# EAGLE design screen (EAGLE 9.6.1)

## Sheet 1 of 2
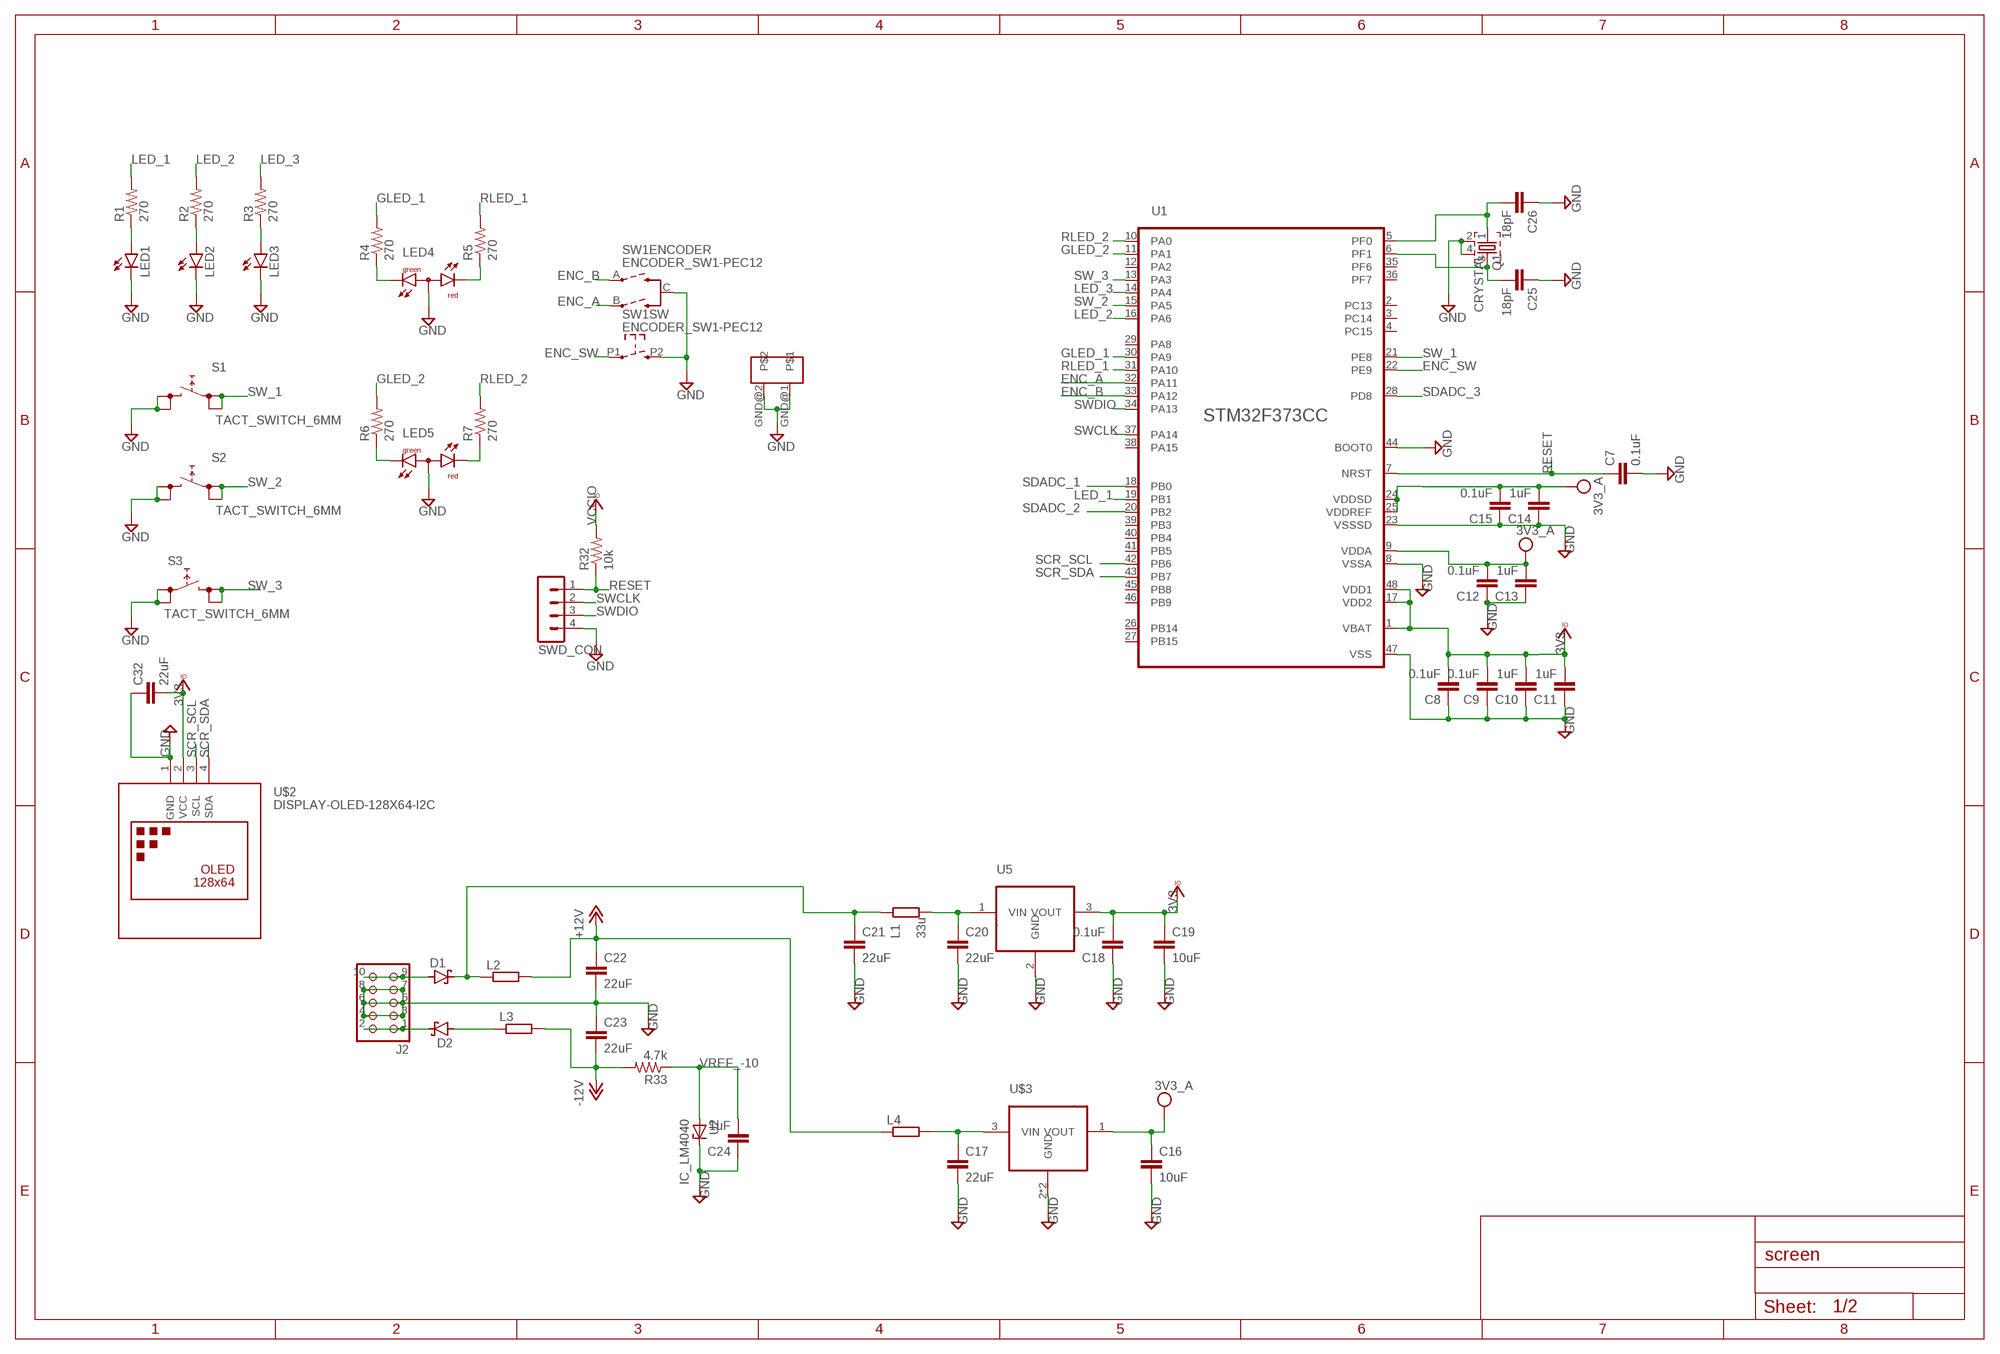
[diagram p0: schematic, sheet 1]

### Parts
C7  0.1uF  C-EUC0603  [C0603]
C8  0.1uF  C-EUC0603  [C0603]
C9  0.1uF  C-EUC0603  [C0603]
C10  1uF  C-EUC0603  [C0603]
C11  1uF  C-EUC0603  [C0603]
C12  0.1uF  C-EUC0603  [C0603]
C13  1uF  C-EUC0603  [C0603]
C14  1uF  C-EUC0603  [C0603]
C15  0.1uF  C-EUC0603  [C0603]
C16  10uF  C-EUC1206  [C1206]
C17  22uF  C-EUC1206  [C1206]
C18  0.1uF  C-EUC0603  [C0603]
C19  10uF  C-EUC1206  [C1206]
C20  22uF  C-EUC1206  [C1206]
C21  22uF  C-EUC1206  [C1206]
C22  22uF  C-EUC1206  [C1206]
C23  22uF  C-EUC1206  [C1206]
C24  1uF  C-EUC0603  [C0603]
C25  18pF  C-EUC0603  [C0603]
C26  18pF  C-EUC0603  [C0603]
C32  22uF  C-EUC1206  [C1206]
D1  SMF5.0AT1  [SOD123FL]
D2  SMF5.0AT1  [SOD123FL]
J2  CON_HEADER_2X05-PTH+SHROUDED_A  [PINSHRD_PTH_2X05]
L1  33u  R-EU_R0805  [R0805]
L2  R-EU_R0603  [R0603]
L3  R-EU_R0603  [R0603]
L4  R-EU_R0603  [R0603]
LED1  LED3MM  [LED3MM]
LED2  LED3MM  [LED3MM]
LED3  LED3MM  [LED3MM]
LED4  L-115WEGW-CA  [DUOLED-A-3MM]
LED5  L-115WEGW-CA  [DUOLED-A-3MM]
Q1  CRYSTAL  [CTS406]
R1  270  R-US_R0603  [R0603]
R2  270  R-US_R0603  [R0603]
R3  270  R-US_R0603  [R0603]
R4  270  R-US_R0603  [R0603]
R5  270  R-US_R0603  [R0603]
R6  270  R-US_R0603  [R0603]
R7  270  R-US_R0603  [R0603]
R32  10k  R-US_R0603  [R0603]
R33  4.7k  R-US_R0603  [R0603]
S1  TACT_SWITCH_6MM  [TACT_SWITCH_6MM]
S2  TACT_SWITCH_6MM  [TACT_SWITCH_6MM]
S3  TACT_SWITCH_6MM  [TACT_SWITCH_6MM]
SW1  ENCODER_SW1-PEC12  [PEC12_INCREMENTAL_ENCODER]
SWD_CON  MA04-1  [MA04-1]
U1  STM32F373LQFP48  [LQFP48]
U2  IC_LM4040  [SOT-23]
U5  R-78E-0.5  [TO-220_RECOM]
U$2  DISPLAY-OLED-128X64-I2C  [DISPLAY-OLED-128X64-I2C]
U$3  LD2981ABUSOT89  [SOT89]

### Nets
+12V: C22.1 L2.2 L4.1 ; also sheet 2
-12V: C23.2 L3.2 R33.2 ; also sheet 2
ENC_A: SW1.B(ENCODER:B) U1.32(PA11)
ENC_B: SW1.A(ENCODER:A) U1.33(PA12)
ENC_SW: SW1.P1 U1.22(PE9)
GLED_1: R4.2 U1.30(PA9)
GLED_2: R6.2 U1.11(PA1)
GND: C7.2 C8.1 C9.1 C10.1 C11.1 C12.1 C13.1 C14.1 C15.1 C16.2 C17.2 C18.1 C19.2 C20.2 C21.2 C22.2 C23.1 C24.1 C25.1 C26.1 C32.1 J2.3 J2.4 J2.5 J2.6 J2.7 J2.8 LED1.K(C) LED2.K(C) LED3.K(C) LED4.2(A) LED5.2(A) Q1.2 Q1.4 S1.P$3 S1.P$4 S2.P$3 S2.P$4 S3.P$1 S3.P$2 SW1.C(ENCODER:C) SW1.GND@1 SW1.GND@2 SW1.P2 SWD_CON.4 U1.8(VSSA) U1.23(VSSSD) U1.44(BOOT0) U1.47(VSS) U2.1(C) U5.2(GND) U$2.1(GND) U$3.2(GND) U$3.2@1(GND) ; also sheet 2
LED_1: R1.2 U1.19(PB1)
LED_2: R2.2 U1.16(PA6)
LED_3: R3.2 U1.14(PA4)
N$3: LED1.A R1.1
N$4: LED2.A R2.1
N$5: LED3.A R3.1
N$6: LED4.1(CG) R4.1
N$7: LED4.3(CR) R5.1
N$8: C25.2 Q1.3 U1.6(PF1)
N$11: D2.C J2.1 J2.2
N$12: LED5.1(CG) R6.1
N$13: LED5.3(CR) R7.1
N$26: D1.A J2.9 J2.10
N$31: C21.1 D1.C L1.1 L2.1
N$32: C26.2 Q1.1 U1.5(PF0)
N$33: C20.1 L1.2 U5.1(VIN)
N$43: C17.1 L4.2 U$3.3(VIN)
N$44: D2.A L3.1
RESET: C7.1 R32.1 SWD_CON.1 U1.7(NRST)
RLED_1: R5.2 U1.31(PA10)
RLED_2: R7.2 U1.10(PA0)
SCR_SCL: U1.42(PB6) U$2.3(SCL)
SCR_SDA: U1.43(PB7) U$2.4(SDA)
SDADC_1: U1.18(PB0) ; also sheet 2
SDADC_2: U1.20(PB2) ; also sheet 2
SDADC_3: U1.28(PD8) ; also sheet 2
SW_1: S1.P$1 S1.P$2 U1.21(PE8)
SW_2: S2.P$1 S2.P$2 U1.15(PA5)
SW_3: S3.P$3 S3.P$4 U1.13(PA3)
SWCLK: SWD_CON.2 U1.37(PA14)
SWDIO: SWD_CON.3 U1.34(PA13)
VCC: C12.2 C13.2 C14.2 C15.2 C16.1 U1.9(VDDA) U1.24(VDDSD) U1.25(VDDREF) U$3.1(VOUT) ; supply symbol labelled 3V3_A ; also sheet 2
VCCIO: C8.2 C9.2 C10.2 C11.2 C18.2 C19.1 C32.2 R32.2 U1.1(VBAT) U1.17(VDD2) U1.48(VDD1) U5.3(VOUT) U$2.2(VCC) ; supply symbol labelled 3V3
VREF_-10: C24.2 R33.1 U2.2(A) U2.3(A) ; also sheet 2
Unconnected: U1.2(PC13) U1.3(PC14) U1.4(PC15) U1.12(PA2) U1.26(PB14) U1.27(PB15) U1.29(PA8) U1.35(PF6) U1.36(PF7) U1.38(PA15) U1.39(PB3) U1.40(PB4) U1.41(PB5) U1.45(PB8) U1.46(PB9)

## Sheet 2 of 2
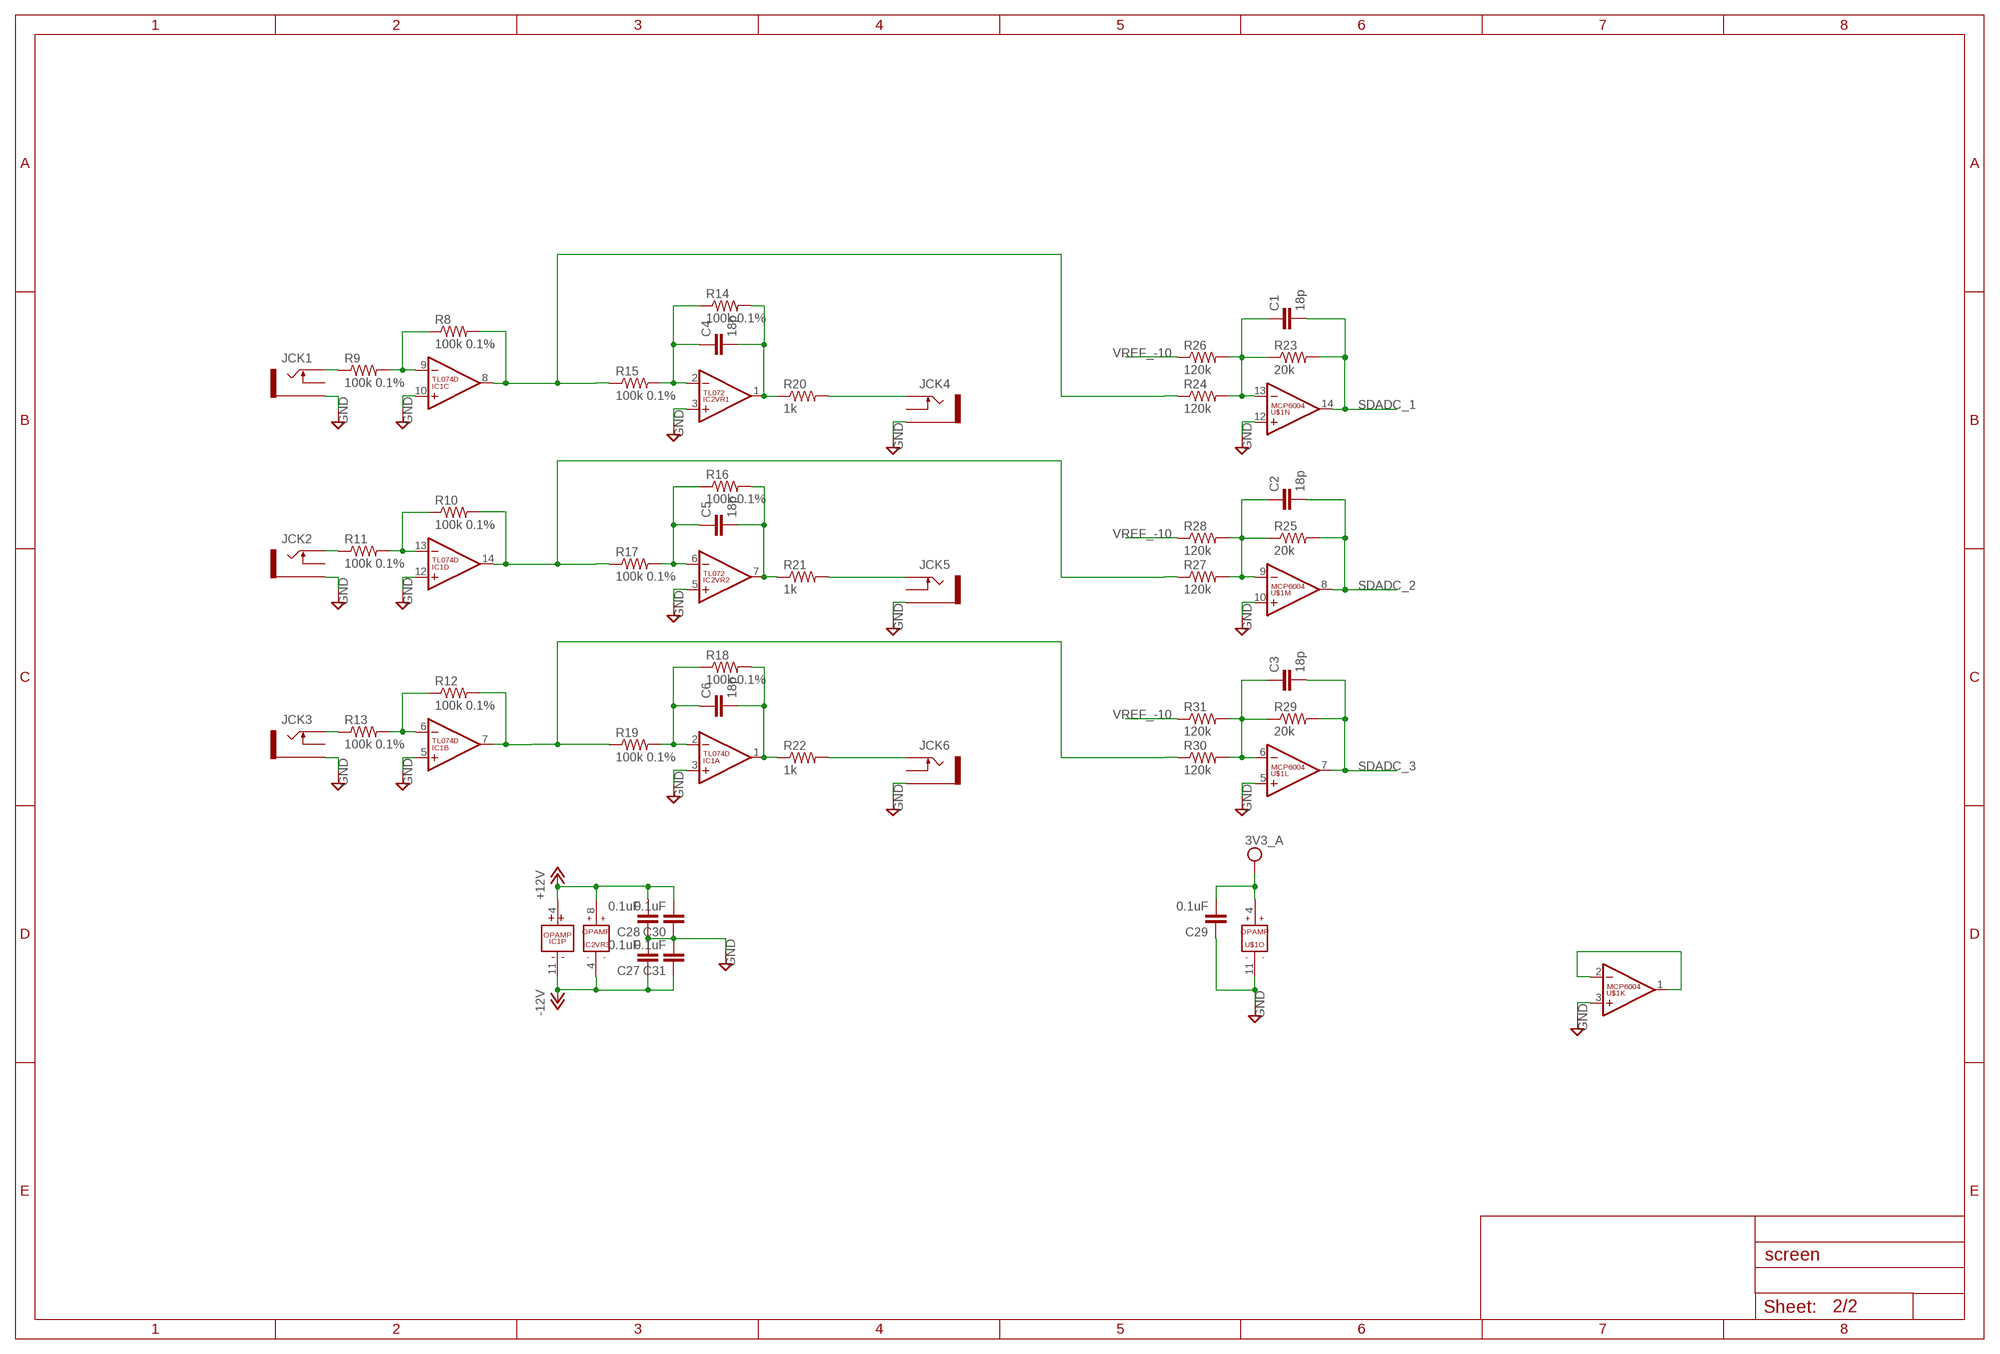
[diagram p1: schematic, sheet 2]

### Parts
C1  18p  C-EUC0603  [C0603]
C2  18p  C-EUC0603  [C0603]
C3  18p  C-EUC0603  [C0603]
C4  18p  C-EUC0603  [C0603]
C5  18p  C-EUC0603  [C0603]
C6  18p  C-EUC0603  [C0603]
C27  0.1uF  C-EUC0603  [C0603]
C28  0.1uF  C-EUC0603  [C0603]
C29  0.1uF  C-EUC0603  [C0603]
C30  0.1uF  C-EUC0603  [C0603]
C31  0.1uF  C-EUC0603  [C0603]
IC1  TL074D  [SO14]
IC2  TL072  [SO08]
JCK1  THONKICONNNEW  [WQP-PJ301M-12_JACK]
JCK2  THONKICONNNEW  [WQP-PJ301M-12_JACK]
JCK3  THONKICONNNEW  [WQP-PJ301M-12_JACK]
JCK4  THONKICONNNEW  [WQP-PJ301M-12_JACK]
JCK5  THONKICONNNEW  [WQP-PJ301M-12_JACK]
JCK6  THONKICONNNEW  [WQP-PJ301M-12_JACK]
R8  100k 0.1%  R-US_R0603  [R0603]
R9  100k 0.1%  R-US_R0603  [R0603]
R10  100k 0.1%  R-US_R0603  [R0603]
R11  100k 0.1%  R-US_R0603  [R0603]
R12  100k 0.1%  R-US_R0603  [R0603]
R13  100k 0.1%  R-US_R0603  [R0603]
R14  100k 0.1%  R-US_R0603  [R0603]
R15  100k 0.1%  R-US_R0603  [R0603]
R16  100k 0.1%  R-US_R0603  [R0603]
R17  100k 0.1%  R-US_R0603  [R0603]
R18  100k 0.1%  R-US_R0603  [R0603]
R19  100k 0.1%  R-US_R0603  [R0603]
R20  1k  R-US_R0603  [R0603]
R21  1k  R-US_R0603  [R0603]
R22  1k  R-US_R0603  [R0603]
R23  20k  R-US_R0603  [R0603]
R24  120k  R-US_R0603  [R0603]
R25  20k  R-US_R0603  [R0603]
R26  120k  R-US_R0603  [R0603]
R27  120k  R-US_R0603  [R0603]
R28  120k  R-US_R0603  [R0603]
R29  20k  R-US_R0603  [R0603]
R30  120k  R-US_R0603  [R0603]
R31  120k  R-US_R0603  [R0603]
U$1  MCP6004  [SO14]

### Nets
+12V: C28.2 C30.2 IC1.4(P:V+) IC2.8(VR3:V+) ; also sheet 1
-12V: C27.1 C31.1 IC1.11(P:V-) IC2.4(VR3:V-) ; also sheet 1
GND: C27.2 C28.1 C29.1 C30.1 C31.2 IC1.3(A:+IN) IC1.5(B:+IN) IC1.10(C:+IN) IC1.12(D:+IN) IC2.3(VR1:+IN) IC2.5(VR2:+IN) JCK1.P$3_SLEEVE(SLEEVE) JCK2.P$3_SLEEVE(SLEEVE) JCK3.P$3_SLEEVE(SLEEVE) JCK4.P$3_SLEEVE(SLEEVE) JCK5.P$3_SLEEVE(SLEEVE) JCK6.P$3_SLEEVE(SLEEVE) U$1.3(K:+IN) U$1.5(L:+IN) U$1.10(M:+IN) U$1.11(O:V-) U$1.12(N:+IN) ; also sheet 1
N$1: IC1.9(C:-IN) R8.1 R9.2
N$2: IC1.13(D:-IN) R10.1 R11.2
N$9: C6.2 IC1.1(A:OUT) R18.2 R22.1
N$10: C1.1 R23.1 R24.2 R26.2 U$1.13(N:-IN)
N$14: JCK1.P$1_TIP(TIP) R9.1
N$15: JCK2.P$1_TIP(TIP) R11.1
N$16: IC1.6(B:-IN) R12.1 R13.2
N$17: C4.2 IC2.1(VR1:OUT) R14.2 R20.1
N$18: JCK3.P$1_TIP(TIP) R13.1
N$19: C4.1 IC2.2(VR1:-IN) R14.1 R15.2
N$20: U$1.1(K:OUT) U$1.2(K:-IN)
N$21: C5.2 IC2.7(VR2:OUT) R16.2 R21.1
N$22: C5.1 IC2.6(VR2:-IN) R16.1 R17.2
N$23: C2.1 R25.1 R27.2 R28.2 U$1.9(M:-IN)
N$25: C6.1 IC1.2(A:-IN) R18.1 R19.2
N$27: C3.1 R29.1 R30.2 R31.2 U$1.6(L:-IN)
N$28: JCK5.P$1_TIP(TIP) R21.2
N$29: JCK4.P$1_TIP(TIP) R20.2
N$30: JCK6.P$1_TIP(TIP) R22.2
SDADC_1: C1.2 R23.2 U$1.14(N:OUT) ; also sheet 1
SDADC_2: C2.2 R25.2 U$1.8(M:OUT) ; also sheet 1
SDADC_3: C3.2 R29.2 U$1.7(L:OUT) ; also sheet 1
SIGNAL_1: IC1.8(C:OUT) R8.2 R15.1 R24.1
SIGNAL_2: IC1.14(D:OUT) R10.2 R17.1 R27.1
SIGNAL_3: IC1.7(B:OUT) R12.2 R19.1 R30.1
VCC: C29.2 U$1.4(O:V+) ; supply symbol labelled 3V3_A ; also sheet 1
VREF_-10: R26.1 R28.1 R31.1 ; also sheet 1
Unconnected: JCK1.P$2_SWITCH(SWITCH) JCK2.P$2_SWITCH(SWITCH) JCK3.P$2_SWITCH(SWITCH) JCK4.P$2_SWITCH(SWITCH) JCK5.P$2_SWITCH(SWITCH) JCK6.P$2_SWITCH(SWITCH)

## Library data of the parts
C1-C32 = resistor:C-EU: CAPACITOR, European symbol
D1 D2 = diode:SMF5.0AT1: 200 W Transient Voltage Suppressor Source: Data sheet <http://www.onsemi.com/pub_link/Collateral/SMF5.0AT1-D.PDF>
IC1 = EurorackModularParts:TL074: OP AMP
IC2 = EurorackModularParts:TL072
J2 = dp_devices:CON_HEADER_2X05: 2x05 pin header
JCK1-JCK6 = BitFox:THONKICONN: 3.5mm socket for Eurorack modular synths
L1-L4 = resistor:R-EU_: RESISTOR, European symbol
LED1-LED3 = led:LED: LED OSRAM: - CHIPLED LG R971, LG N971, LY N971, LG Q971, LY Q971, LO R971, LY R971 LH N974, LH R974 LS Q976, LO Q976, LY Q976 LO Q996 - Hyper CHIPLED LW Q18S LB Q993, LB Q99A, LB R99A - SideLED LS A670, LO A670, LY A670, LG A670, LP A670 LB A673, LV A673, LT A673, LW A673 LH A674 LY A675 LS A676, LA A676, LO A676, LY A676, LW A676 LS A679, LY A679, LG A679 - Hyper Micro SIDELED® LS Y876, LA Y876, LO Y876, LY Y876 LT Y87S - SmartLED LW L88C, LW L88S LB L89C, LB L89S, LG L890 LS L89K, LO L89K, LY L89K LS L896, LA L896, LO L896, LY L896 - TOPLED LS T670, LO T670, LY T670, LG T670, LP T670 LSG T670, LSP T670, LSY T670, LOP T670, LYG T670 LG T671, LOG T671, LSG T671 LB T673, LV T673, LT T673, LW T673 LH T674 LS T676, LA T676, LO T676, LY T676, LB T676, LH T676, LSB T676, LW T676 LB T67C, LV T67C, LT T67C, LS T67K, LO T67K, LY T67K, LW E67C LS E67B, LA E67B, LO E67B, LY E67B, LB E67C, LV E67C, LT E67C LW T67C LS T679, LY T679, LG T679 LS T770, LO T770, LY T770, LG T770, LP T770 LB T773, LV T773, LT T773, LW T773 LH T774 LS E675, LA E675, LY E675, LS T675 LS T776, LA T776, LO T776, LY T776, LB T776 LHGB T686 LT T68C, LB T68C - Hyper Mini TOPLED® LB M676 - Mini TOPLED Santana® LG M470 LS M47K, LO M47K, LY M47K Source: http://www.osram.convergy.de LUXEON: - LUMILED® LXK2-PW12-R00, LXK2-PW12-S00, LXK2-PW14-U00, LXK2-PW14-V00 LXK2-PM12-R00, LXK2-PM12-S00, LXK2-PM14-U00 LXK2-PE12-Q00, LXK2-PE12-R00, LXK2-PE12-S00, LXK2-PE14-T00, LXK2-PE14-U00 LXK2-PB12-K00, LXK2-PB12-L00, LXK2-PB12-M00, LXK2-PB14-N00, LXK2-PB14-P00, LXK2-PB14-Q00 LXK2-PR12-L00, LXK2-PR12-M00, LXK2-PR14-Q00, LXK2-PR14-R00 LXK2-PD12-Q00, LXK2-PD12-R00, LXK2-PD12-S00 LXK2-PH12-R00, LXK2-PH12-S00 LXK2-PL12-P00, LXK2-PL12-Q00, LXK2-PL12-R00 Source: www.luxeon.com KINGBRIGHT: KA-3528ASYC Source: www.kingbright.com
LED4 LED5 = led:L-115WEGW-CA: T-1(3mm) BI-COLOR INDICATOR LAMP Source: Kingbright .. 2_colour_led_.pdf
Q1 = BitFox:CRYSTAL
R1-R33 = resistor:R-US_: RESISTOR, American symbol
S1-S3 = BitFox:TACT_SWITCH_6MM
SW1 = dp_devices.v6:ENCODER_SW1: Incremental Encoder with push switch
SWD_CON = con-lstb:MA04-1: PIN HEADER; OC_FARNELL: unknown; OC_NEWARK: unknown
U1 = BitFox:STM32F373
U2 = dp_devices.v6:IC_LM4040: LM4040 Precision Micropower Shunt Voltage Reference
U5 = BitFox:R-78E-0.5
U$1 = EurorackModularParts:MCP6004
U$2 = diy-modules:DISPLAY-OLED-128X64-I2C: 128x64 Dot Matrix OLED Module based on SSD1306 chip Variant with I2C interface More details available here: http://www.instructables.com/id/Monochrome-096-i2c-OLED-display-with-arduino-SSD13/ SSD1306 datasheet: https://cdn-shop.adafruit.com/datasheets/SSD1306.pdf Click here to find device on ebay.com <http://www.ebay.com/sch/oled+display+128x64+iic> Note: There are two variants: I2C and SPI. Search for the proper version.
U$3 = BitFox:LD2981ABU

## Board
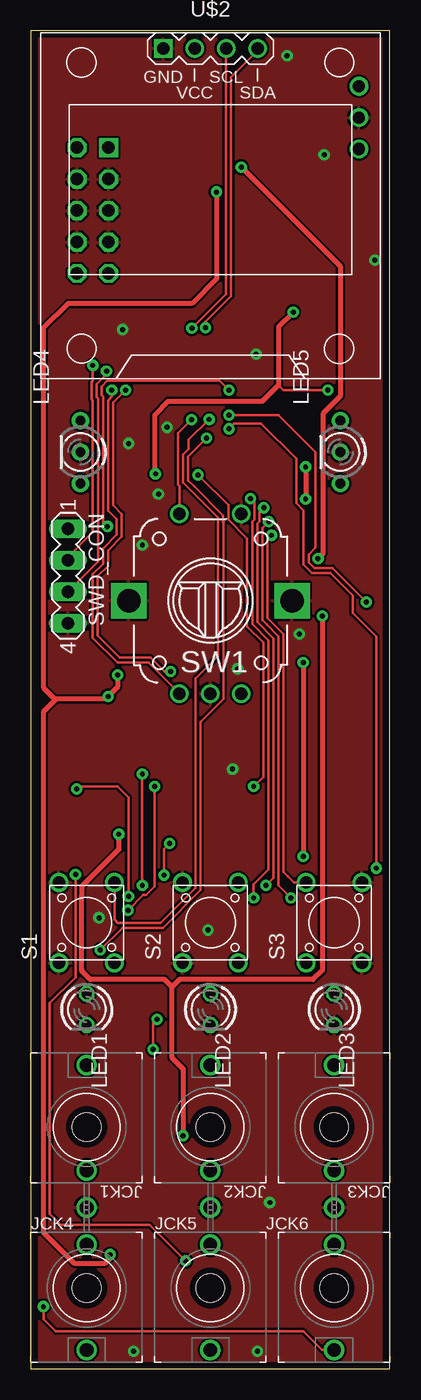
[diagram p2: board, top side]
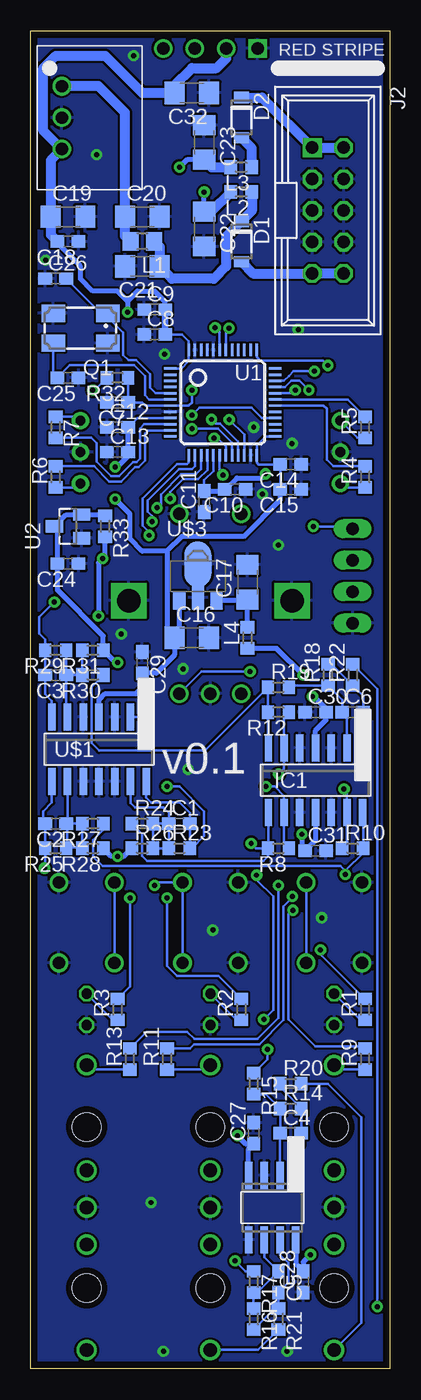
[diagram p3: board, bottom side, seen from below]

Size 29 x 108 mm. Coordinates in mm from the lower left corner, seen from the top.
Outline: 0,0 29,0 29,108 0,108 0,0
Copper layers (1*16): Top 0.035mm / dielectric 1.5mm / Bottom 0.035mm
Design rules "PCBCart-Standard *": minimum track width 8mil, minimum drill 0.4mm, track to track 7mil, track to pad 7mil, pad to pad 7mil, via to via 7mil, smd to smd 7mil, copper to edge 20mil, drill to drill 8mil, minimum pad ring 8mil, minimum via ring 10mil, stop-mask expansion 3mil, vias tented up to drill 25mil, thermal gap 8mil

### Footprints (pad centres in the part's own frame; a part is rotated, then mirrored left to right if it is on the bottom)
C0603 = smd 1.1 x 1: 1 -0.85,0; 2 0.85,0
C1206 = smd 1.6 x 1.8: 1 -1.4,0; 2 1.4,0
SOD123FL = smd 0.91 x 1.22: A 1.625,0; C -1.625,0
SO14 = smd 0.6 x 2.2: 1 -3.81,-2.6; 2 -2.54,-2.6; 3 -1.27,-2.6; 4 0,-2.6; 5 1.27,-2.6; 6 2.54,-2.6; 7 3.81,-2.6; 8 3.81,2.6; 9 2.54,2.6; 10 1.27,2.6; 11 0,2.6; 12 -1.27,2.6; 13 -2.54,2.6; 14 -3.81,2.6
SO08 = smd 0.6 x 2.2: 1 -1.905,-2.6; 2 -0.635,-2.6; 3 0.635,-2.6; 4 1.905,-2.6; 5 1.905,2.6; 6 0.635,2.6; 7 -0.635,2.6; 8 -1.905,2.6
PINSHRD_PTH_2X05 = drill 1.016 square: 1 -5.08,-1.27 | drill 1.016 octagon: 2 -5.08,1.27; 3 -2.54,-1.27; 4 -2.54,1.27; 5 0,-1.27; 6 0,1.27; 7 2.54,-1.27; 8 2.54,1.27; 9 5.08,-1.27; 10 5.08,1.27
WQP-PJ301M-12_JACK = drill 1.1: P$1_TIP 0,5; P$2_SWITCH 0,-3.5; P$3_SLEEVE 0,-6.5 | hole 2.286: 0,0
R0805 = smd 1.3 x 1.5: 1 -0.95,0; 2 0.95,0
R0603 = smd 1 x 1.1: 1 -0.85,0; 2 0.85,0
LED3MM = drill 0.813 octagon: A -1.27,0; K 1.27,0
DUOLED-A-3MM = drill 0.8 pad 1.4: 1 -2.54,0; 2 0,0; 3 2.54,0
CTS406 = smd 1.9 x 1.4: 1 -2.2,-1.2; 2 2.2,-1.2; 3 2.2,1.2; 4 -2.2,1.2
TACT_SWITCH_6MM = drill 1: P$1 -3.25,-2.25; P$2 3.25,-2.25; P$3 -3.25,2.25; P$4 3.25,2.25
PEC12_INCREMENTAL_ENCODER = drill 1: A -2.5,-7.5; B 2.5,-7.5; C 0,-7.5; P1 -2.5,7; P2 2.5,7 | drill 1.9 square: GND@1 -6.6,0; GND@2 6.6,0
MA04-1 = drill 1.016 long: 1 -3.81,0; 2 -1.27,0; 3 1.27,0; 4 3.81,0
LQFP48 = smd 1 x 0.2: 1 -4.25,2.75; 2 -4.25,2.25; 3 -4.25,1.75; 4 -4.25,1.25; 5 -4.25,0.75; 6 -4.25,0.25; 7 -4.25,-0.25; 8 -4.25,-0.75; 9 -4.25,-1.25; 10 -4.25,-1.75; 11 -4.25,-2.25; 12 -4.25,-2.75; 25 4.25,-2.75; 26 4.25,-2.25; 27 4.25,-1.75; 28 4.25,-1.25; 29 4.25,-0.75; 30 4.25,-0.25; 31 4.25,0.25; 32 4.25,0.75; 33 4.25,1.25; 34 4.25,1.75; 35 4.25,2.25; 36 4.25,2.75 | smd 0.2 x 1: 13 -2.75,-4.25; 14 -2.25,-4.25; 15 -1.75,-4.25; 16 -1.25,-4.25; 17 -0.75,-4.25; 18 -0.25,-4.25; 19 0.25,-4.25; 20 0.75,-4.25; 21 1.25,-4.25; 22 1.75,-4.25; 23 2.25,-4.25; 24 2.75,-4.25; 37 2.75,4.25; 38 2.25,4.25; 39 1.75,4.25; 40 1.25,4.25; 41 0.75,4.25; 42 0.25,4.25; 43 -0.25,4.25; 44 -0.75,4.25; 45 -1.25,4.25; 46 -1.75,4.25; 47 -2.25,4.25; 48 -2.75,4.25
SOT-23 = smd 1 x 1.4: 1 -0.95,-1.1; 2 0.95,-1.1; 3 0,1.1
TO-220_RECOM = drill 1: 1 -2.54,0; 2 0,0; 3 2.54,0
DISPLAY-OLED-128X64-I2C = drill 1 square: 1 -3.81,12.7 | drill 1: 2 -1.27,12.7; 3 1.27,12.7; 4 3.81,12.7
SOT89 = smd 1 x 1.5: 1 -1.499,-1.981; 3 1.499,-1.981 | smd 1 x 2: 2 0,-1.727 | smd 2.2 x 3.7: 2@1 0,0.94

### Placement (x,y rotation side)
C1  17,44 0 bottom
C2  27,44 180 bottom
C3  27,56 180 bottom
C4  8,19 0 bottom
C5  9,7 270 bottom
C6  3,53 0 bottom
C7  22,78 180 bottom
C8  19,83.5 0 bottom
C9  19,85.5 0 bottom
C10  12.5,71 180 bottom
C11  15,70 90 bottom
C12  22,76 0 bottom
C13  22,74 0 bottom
C14  8,73 180 bottom
C15  8,71 180 bottom
C16  16,59 0 bottom
C17  11.5,63.5 90 bottom
C18  26,91 180 bottom
C19  26,93 0 bottom
C20  20,93 0 bottom
C21  20,89 180 bottom
C22  15,92 270 bottom
C23  15,99 270 bottom
C24  26,65 180 bottom
C25  26,80 180 bottom
C26  27,88 0 bottom
C27  11,19 90 bottom
C28  7,7 90 bottom
C29  20,57 270 bottom
C30  6,53 0 bottom
C31  6,41.8 0 bottom
C32  16,103 180 bottom
D1  12,91 270 bottom
D2  12,101 270 bottom
IC1  6,47.5 180 bottom
IC2  9.5,13 180 bottom
J2  5,93.5 270 bottom
JCK1  4.5,19.5 0 top
JCK2  14.5,19.5 0 top
JCK3  24.5,19.5 0 top
JCK4  4.5,6.5 180 top
JCK5  14.5,6.5 180 top
JCK6  24.5,6.5 180 top
L1  20,91 180 bottom
L2  12,95 180 bottom
L3  12,97 180 bottom
L4  11.5,59 90 bottom
LED1  4.5,29 270 top
LED2  14.5,29 270 top
LED3  24.5,29 270 top
LED4  4,74 90 top
LED5  25,74 90 top
Q1  25,84 180 bottom
R1  2,29 90 bottom
R2  12,29 90 bottom
R3  22,29 90 bottom
R4  2,72 90 bottom
R5  2,76 90 bottom
R6  27,72 90 bottom
R7  27,76 270 bottom
R8  9,42 180 bottom
R9  2,25 90 bottom
R10  3,42 0 bottom
R11  18,25 90 bottom
R12  9,53 180 bottom
R13  21,25 90 bottom
R14  8,21 0 bottom
R15  11,23 270 bottom
R16  11,4 270 bottom
R17  11,7 270 bottom
R18  5,56 90 bottom
R19  9,55 0 bottom
R20  8,23 0 bottom
R21  9,4 270 bottom
R22  3,56 90 bottom
R23  17,42 0 bottom
R24  20,44 0 bottom
R25  27,42 180 bottom
R26  20,42 0 bottom
R27  24,44 180 bottom
R28  24,42 180 bottom
R29  27,58 180 bottom
R30  24,56 180 bottom
R31  24,58 180 bottom
R32  22,80 180 bottom
R33  23,68 270 bottom
S1  4.5,36 90 top
S2  14.5,36 90 top
S3  24.5,36 90 top
SW1  14.5,62 0 top
SWD_CON  3,64 270 top
U1  13.5,78 0 bottom
U2  26,68 90 bottom
U5  26.5,101 270 bottom
U$1  23.5,50 180 bottom
U$2  14.5,93.9 0 top
U$3  15.5,64 0 bottom

### Tracks (layer width: path | path; a pad name or v marks a point on that pad's centre or on a via)
+12V  (via drill 0.4)
  Top 0.406: v15,95 15,88 13,86 3,86 1,84 1,55 1.94,54.06 | 1.94,54.06 1.94,53.94 1,53 1,11 3.5,8.5 6,8.5 6.4,8.9 v6.4,9.2 | v7,56 7,55.03 v6.24,54.27 6.04,54.06 1.94,54.06
  Bottom 0.406: IC1.4 6,51.5 5.15,52.35 C30.2 5.15,53.28 6.13,54.27 v6.24,54.27 | C22.1 v15,95 | v7,56 9.15,58.15 L4.1 | IC2.8 7.59,8.45 C28.2 7,8.6 v6.4,9.2
  Bottom 0.813: L2.2 14.45,93.4 C22.1
-12V  (via drill 0.4)
  Top 0.406: v23.2,65.4 23.6,65.8 23.6,77.1 25,78.5 25,89 v17,97 | v23.54,60.76 23.54,32.14 23.5,32.1 22.8,31.4 12,31.4 11.4,30.8 | v12.3,18.8 12.3,24.2 11.4,25.1 11.4,30.8 | 11.4,30.8 10.8,31.4 4.8,31.4 4.11,32.09 4.11,32.2 4.11,38.2 4.11,38.91 7.1,41.9 v7.1,43.14
  Bottom 0.406: C23.2 16.4,97.6 v17,97 | IC2.4 11.4,17.75 C27.1 11.65,18.15 v12.3,18.8 | R33.2 23,65.6 v23.2,65.4 23.54,65.06 v23.54,60.76 | IC1.11 6,42.65 C31.1 7.1,42.05 v7.1,43.14
  Bottom 0.813: C23.2 14.4,97 L3.2
ENC_A  (via drill 0.4)
  Top 0.203: v11.29,56.29 10.79,56.29 9.67,57.41 7.17,57.41 5.41,59.17 5.41,63.99 6.22,64.81 6.22,66.05 7.33,67.16 7.33,69 6.63,69.7 6.63,78 v7.64,79.01
  Bottom 0.203: SW1.B 15.21,56.29 v11.29,56.29 | U1.32 7.94,78.75 7.68,79.01 v7.64,79.01
ENC_B  (via drill 0.4)
  Top 0.203: SW1.A 9.5,57 7,57 5,59 5,64.16 5.82,64.97 5.82,66.22 6.93,67.33 6.93,68.57 6.22,69.28 6.22,78.16 6.53,78.47 v6.53,79.01
  Bottom 0.203: 9,79.25 U1.33 | 9,79.25 8.47,79.25 | 8.47,79.25 7.96,79.77 7.29,79.77 v6.53,79.01 | 9,79.25 8.47,79.25
ENC_SW  (via drill 0.4)
  Top 0.203: SW1.P1 12,71.26 11.89,71.38 11.89,75.53 v12.98,76.62
  Bottom 0.203: v12.98,76.62 11.75,75.4 U1.22
GLED_1
  Bottom 0.203: U1.30 5.35,77.75 5.1,77.5 5.1,73.4 4.55,72.85 R4.2
GLED_2
  Bottom 0.203: U1.11 19.55,75.75 19.79,75.51 19.79,73.3 20.3,72.79 20.56,72.79 21.72,71.64 22.68,71.64 23.9,72.85 R6.2
GND  (via drill 0.4)
  other vias: 11,76 10.3,70.6 7.9,74.7 9,66.5 16.3,48.4 21.7,59.3 18.3,1.4 8.3,1.4 19.3,13.4 14.3,35.4 7.4,83.9 20.7,106 5.5,36.4 18.2,81.9 23.7,98 27.8,89.5 16.7,56.5
  pour Bottom: 29,0 0,0 0,108 29,108
  pour Top: 29,0 0,0 0,108 29,108
LED_1  (via drill 0.4)
  Top 0.203: v5.6,33.8 7.39,35.59 10.66,35.59 13.71,38.65 13.71,52.22 15.55,54.06 15.55,68.38 15.54,68.39 15.54,68.87 13.21,71.21 12.7,71.71 12.7,73.63 v14.19,75.12
  Bottom 0.203: R1.2 5.6,33.45 v5.6,33.8 | U1.19 13.25,74.45 13.92,75.12 v14.19,75.12
LED_2  (via drill 0.4)
  Top 0.203: v18,38 18,39.1 19.19,40.29 19.19,58.79 17.88,60.09 17.88,68.39 18.05,68.56 18.05,69.94 v17.75,70.25
  Bottom 0.203: R2.2 13.85,31.7 17.19,31.7 18,32.51 v18,38 | U1.16 14.75,72.55 15.5,71.8 16.7,71.8 17.75,70.75 v17.75,70.25
LED_3  (via drill 0.4)
  Top 0.203: v21,38 20,39 20,59.12 19.06,60.06 | 19.06,60.06 18.69,60.43 | 19.06,60.06 18.69,60.43 | 18.69,60.43 18.69,67.86 v19.22,68.39
  Bottom 0.203: R3.2 21,30.85 v21,38 | U1.14 15.75,72.86 16,72.61 17.04,72.61 19.57,70.08 19.57,69.19 19.22,68.83 v19.22,68.39
N$1  (via drill 0.4)
  Top 0.203: v7.83,37 9.08,38.24 9.31,38.24 10,38.93 v10,47
  Bottom 0.203: R8.1 8.54,42.39 IC1.9 8.54,46.24 9.3,47 v10,47 | R9.2 2.15,26 6,26 8.19,28.19 8.19,36.65 v7.83,37
N$2  (via drill 0.4)
  Top 0.203: v7.88,38.12 7.88,46.12 7,47 3.9,47 v3.7,46.8
  Bottom 0.203: R10.1 3.46,42.39 IC1.13 3.46,46.56 v3.7,46.8 | R11.2 16.15,25.85 15.81,26.19 15.7,26.19 10.53,26.19 8.59,28.13 8.59,30 8.59,37 8.59,37.31 7.88,38.03 v7.88,38.12
N$3
  Bottom 0.203: LED1.A 2.38,28.15 R1.1
N$4
  Bottom 0.203: LED2.A 12.38,28.15 R2.1
N$5
  Bottom 0.203: LED3.A 22.38,28.15 R3.1
N$6
  Bottom 0.203: R4.1 3.69,71.15 LED4.1
N$7
  Bottom 0.203: LED4.3 2.61,75.15 R5.1
N$8
  Bottom 0.203: U1.6 19.45,78.25 19.79,78.59 19.79,80.12 20.67,81 25.85,81 C25.2 | 26.93,80.08 27.2,80.35 Q1.3
  Bottom 0.305: 26.93,80.08 C25.2
N$9
  Bottom 0.203: IC1.1 2.15,50.14 C6.2 2.15,54.3 R22.1 4.7,56.85 R18.2
N$10
  Bottom 0.203: C1.1 R24.2 R26.2 R23.1 C1.1 | C1.1 17.85,44.85 18.2,45.2 18.3,45.3 20.6,45.3 20.96,45.66 U$1.13
N$11
  Bottom 0.813: D2.C 10.31,102.62 J2.1 J2.2
N$12
  Bottom 0.203: R6.1 25.31,71.15 LED5.1
N$13
  Bottom 0.203: R7.1 25.31,76.85 LED5.3
N$14
  Bottom 0.203: R9.1 4.15,24.15 JCK1.P$1_TIP
N$15
  Bottom 0.203: R11.1 14.85,24.15 JCK2.P$1_TIP
N$16  (via drill 0.4)
  Top 0.203: v9,39 v9,48
  Bottom 0.203: R12.1 8.54,52.61 IC1.6 8.54,48.46 v9,48 | R13.2 19.65,27.2 16.4,27.2 15.8,26.6 10.7,26.6 9,28.3 v9,39
N$17
  Bottom 0.203: IC2.1 7.59,17.41 7,18 7,18.85 C4.2 R14.2 8.85,22.7 R20.1
N$18
  Bottom 0.203: JCK3.P$1_TIP 24.15,24.15 R13.1
N$19
  Bottom 0.203: IC2.2 8.87,18.98 C4.1 | C4.1 9,19 | R15.2 10,22.15 R14.1 C4.1
N$20
  Bottom 0.203: U$1.2 U$1.1
N$21
  Bottom 0.203: IC2.7 8.87,9.2 8.2,8.53 8.2,6.96 C5.2 | C5.2 8.65,6.15 | R16.2 9.3,4.85 R21.1 C5.2
N$22
  Bottom 0.203: R16.1 R17.2 10.7,6.15 C5.1 10.13,8.98 IC2.6
N$23
  Bottom 0.203: 26.07,44.08 C2.1 R27.2 R28.2 24.93,42.08 26.07,42.08 | 26.07,44.08 26.04,44.11 U$1.9 | R25.1 26.07,42.08 | 26.07,42.08 26.07,44.08
N$25
  Bottom 0.203: IC1.2 3.46,52.61 C6.1 3.85,54 R18.1 8,55.15 R19.2
N$26
  Bottom 0.813: D1.A 11.04,88.42 J2.9 J2.10
N$27
  Bottom 0.203: C3.1 26.15,52.71 U$1.6 | C3.1 R29.1 | R31.2 R30.2 C3.1
N$28
  Bottom 0.203: R21.2 10.65,1.5 JCK5.P$1_TIP
N$29
  Bottom 0.203: JCK4.P$1_TIP 2.3,3.7 2.3,20.3 5,23 R20.2
N$30  (via drill 0.4)
  Top 0.203: JCK6.P$1_TIP 23.5,1.5 22,3 2,3 1.01,3.99 v1.01,5
  Bottom 0.203: v1.01,5 1.01,54.86 R22.2
N$31
  Bottom 0.813: L2.1 11.15,93.47 D1.C 13.22,91.41 13.22,89 14.22,88 17.6,88 C21.1 18.6,90.55 L1.1
N$32
  Bottom 0.203: U1.5 18.94,78.75 19.39,79.2 19.39,80.29 20.5,81.41 21.11,81.41 21.55,81.84 21.55,83.63 22.8,84.88 Q1.1 23.35,85.2 C26.2
N$33
  Bottom 0.813: L1.2 21.4,91.45 C20.1 21.4,101.4 23.54,103.54 U5.1
N$43
  Bottom 0.406: L4.2 C17.1 11.58,62.02 U$3.3
N$44
  Bottom 0.813: L3.1 11.15,98.53 D2.A
RESET  (via drill 0.4)
  Top 0.203: 6.08,68.08 v6.17,68 5.82,68.35 | 5.82,68.35 6.08,68.08 | 6.08,68.08 5.82,68.35 | 5.82,68.35 5.82,77 5.82,78 5.82,78.48 5.7,78.6 5.7,79.3 6.17,79.77 15.23,79.77 v16,79
  Bottom 0.203: C7.1 21,78 | 21,78 20,78 19.75,77.75 U1.7 16.25,77.75 16,78 v16,79 | R32.1 21.15,78.15 21,78 | SWD_CON.1 3.19,68 v6.17,68
RLED_1
  Bottom 0.203: R5.2 3.4,78.25 7.37,78.25 7.38,78.24 8.01,78.24 8.02,78.25 U1.31
RLED_2
  Bottom 0.203: R7.2 24.15,75.15 23.7,74.7 23.7,73.23 22.51,72.04 21.89,72.04 20.73,73.19 20.47,73.19 20.2,73.47 20.2,75.9 19.85,76.25 U1.10
SCR_SCL  (via drill 0.4)
  Top 0.203: v13,84 15.77,86.77 U$2.3
  Bottom 0.203: U1.42 13.25,83.75 v13,84
SCR_SDA  (via drill 0.4)
  Top 0.203: v14.11,84.04 14.11,84.54 16.18,86.6 16.18,104.28 18.31,106.41 U$2.4
  Bottom 0.203: U1.43 13.75,83.68 v14.11,84.04
SDADC_1  (via drill 0.4)
  Top 0.203: v18,47 18.78,47.78 18.78,58.62 17.47,59.93 17.47,67.03 15.95,68.56 15.95,69.71 v13.49,72.16
  Bottom 0.203: U$1.14 19.69,46.09 19.31,45.71 17.01,45.71 16.15,44.85 C1.2 R23.2 16,42 15,43 15,45 17,47 v18,47 | U1.18 13.75,72.41 v13.49,72.16
SDADC_2  (via drill 0.4)
  Top 0.203: v27.9,40.4 27.9,59.1 26,61 26,62.42 24.19,64.23 22.72,64.23 22.04,64.92 22.04,69.29 21.44,69.89 21.44,73.46 18.6,76.3 16.42,76.3 v16,75.88
  Bottom 0.203: U$1.8 27.31,45.69 28,45 28,44.15 C2.2 R25.2 27.85,40.45 v27.9,40.4 | U1.20 12.75,74.75 13.88,75.88 v16,75.88
SDADC_3  (via drill 0.4)
  Top 0.203: v16,76.99 19.99,76.99 23,73.98 23,66.27 22.44,65.71 22.44,65.09 22.89,64.64 24.36,64.64 v27.11,61.89
  Bottom 0.203: U$1.7 27.31,53.91 27.85,54.45 C3.2 R29.2 27.85,58.85 28.34,59.34 28.34,60.66 v27.11,61.89 | U1.28 10.35,76.75 11.2,77.6 15.39,77.6 v16,76.99
SIGNAL_1  (via drill 0.4)
  Top 0.203: v9.88,25.78 9.88,27.88 v10.19,28.19 | v10.76,39.84 10.76,41.96 v11.2,42.4
  Bottom 0.203: IC1.8 9.81,42.04 R8.2 | R24.1 20,43.15 20,41.37 19.63,41 10.2,41 9.85,41.35 R8.2 | R15.1 9.88,24.97 v9.88,25.78 | v10.19,28.19 9.41,28.97 9.41,38.11 10.76,39.46 v10.76,39.84 | v11.2,42.4 10.8,42 R8.2
SIGNAL_2  (via drill 0.4)
  Top 0.203: v3.6,39.9 3.6,31.6 1.51,29.51 1.51,12.49 2.4,11.6 9.6,11.6 v12.5,8.7
  Bottom 0.203: R27.1 23.15,43.48 23.95,42.68 23.95,41.32 23.23,40.59 4,40.59 3.6,40.19 3.6,40 | IC1.14 2.15,44.86 R10.2 2.15,41.65 3.6,40.2 3.6,40 | 3.6,40 v3.6,39.9 3.6,40 | v12.5,8.7 11.65,7.85 R17.1
SIGNAL_3
  Bottom 0.203: IC1.7 9.85,50.14 R12.2 R19.1 14.95,49.9 23.5,49.9 24.11,50.51 24.11,55.05 R30.1
SW_1  (via drill 0.4)
  Top 0.203: S1.P$2 6.75,36.25 7,36 10.49,36 13.3,38.81 13.3,55.7 15.13,57.53 15.13,68.7 12.29,71.54 12.29,72 12.29,73.8 12.75,74.25 12.75,74.99 v14.4,76.64
  Bottom 0.203: S1.P$2 S1.P$1 | v14.4,76.64 14.05,76.29 13.71,76.29 12.25,74.83 U1.21
SW_2  (via drill 0.4)
  Top 0.203: v19,39 19.59,39.59 19.59,58.96 18.29,60.26 18.29,68.22 18.46,68.39 18.46,69.15 v18.81,69.5
  Bottom 0.203: S2.P$1 S2.P$2 18.75,39.25 v19,39 | v18.81,69.5 18.5,69.81 18.5,70.57 16.87,72.21 15.67,72.21 15.25,72.62 U1.15
SW_3  (via drill 0.4)
  Top 0.203: S3.P$4 21.25,39.25 20.75,39.75 20.41,40.09 20.41,59.29 19.1,60.6 19.1,66.92 v19.45,67.28
  Bottom 0.203: S3.P$4 S3.P$3 | U1.13 16.25,73.17 16.4,73.02 17.2,73.02 19.98,70.25 19.98,68.07 19.45,67.55 v19.45,67.28
SWCLK  (via drill 0.4)
  Top 0.203: SWD_CON.2 3,65.54 5,67.54 5,78.15 4.89,78.26 4.89,79.64 5,79.75 v5,81
  Bottom 0.203: U1.37 10.75,81.65 10.5,81.4 5.4,81.4 v5,81
SWDIO  (via drill 0.4)
  Top 0.203: SWD_CON.3 5.41,65.14 5.41,78.31 5.29,78.43 5.29,79.47 6.1,80.27 v6.1,80.53
  Bottom 0.203: U1.34 8.55,79.75 8.15,80.15 7.77,80.53 v6.1,80.53
VCC  (via drill 0.4)
  Top 0.406: v22.2,72.8 v22.2,70.2
  Bottom 0.203: U1.25 10.05,75.25 10.75,74.55 U1.24 10.75,73.15 10.6,73 C14.2 C15.2 | C12.2 20.4,76.75 U1.9
  Bottom 0.406: C16.1 17,59.4 U$3.1 | C16.1 17.4,57.6 18.85,56.15 C29.2 20,55 20.5,54.5 23,54.5 23.5,54 U$1.4 | C16.1 18,59.6 | C15.2 8.85,70.15 11.8,67.2 16.8,67.2 18,66 | C12.2 C13.2 21,73.85 22.05,72.8 v22.2,72.8 | 18,59.6 C16.1 | 18,66 18,59.6 | 18,66 20,66 21,67 21,69 v22.2,70.2
VCCIO  (via drill 0.4)
  Top 0.203: v24,79 20.4,79 20,79.4
  Top 0.406: v21.19,85.3 20,84.11 20,79.4 18.7,78.1 11.1,78.1 10,77 10,72.3 v10.06,72.24
  Bottom 0.203: U1.1 16.85,80.75 16.25,81.35 U1.48 16.25,82.95 16.8,83.5 C8.2 | R32.2 23.85,79 v24,79 | U1.17 14.25,72.47 15,71.72 C11.2
  Bottom 0.406: C9.2 18.15,86.15 19,87 20.39,87 21.19,86.19 | C18.2 26.85,90.85 25,89 25,88 24,87 22,87 21.19,86.19 | 21.19,86.19 v21.19,85.3 | C11.2 13.5,70.85 C10.2 13.28,71 12.37,71.91 10.39,71.91 v10.06,72.24
  Bottom 0.508: C9.2 C8.2
  Bottom 0.813: C18.2 27.4,91.55 C19.1 27.4,97.56 U5.3 28,99.96 28,105 27,106 23,106 20,103 C32.2 17.4,103.6 16,105 14,105 13.23,105.77 U$2.2
VREF_-10  (via drill 0.4)
  Top 0.406: v22,57 v22,41.35
  Bottom 0.406: R33.1 23.1,68.95 U2.2 26.15,68.95 U2.3 26.85,67.75 C24.2 26.85,62.85 23.15,59.15 R31.1 22.15,57 v22,57 | R26.1 21.5,41.35 v22,41.35 22.5,41.35 R28.1

### Text on the board
bPlace: RED STRIPE | v0.1